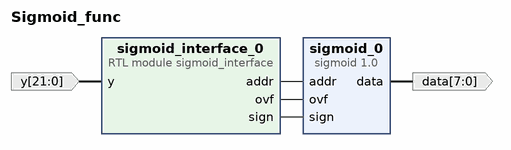
[diagram p0: block diagram of the top level]
# Vivado block design Sigmoid_func, xc7a35tcpg236-1, Vivado 2022.2
create_bd_design Sigmoid_func

create_bd_port -dir I -from 21 -to 0 y
create_bd_port -dir O -from 7 -to 0 data

create_bd_cell -type ip -vlnv siu.edu:user:sigmoid:1.0 sigmoid_0
create_bd_cell -type module -reference sigmoid_interface sigmoid_interface_0

# ---- connections ----

connect_bd_net [get_bd_pins sigmoid_0/data] [get_bd_ports data]
connect_bd_net [get_bd_pins sigmoid_interface_0/addr] [get_bd_pins sigmoid_0/addr]
connect_bd_net [get_bd_pins sigmoid_interface_0/ovf] [get_bd_pins sigmoid_0/ovf]
connect_bd_net [get_bd_pins sigmoid_interface_0/sign] [get_bd_pins sigmoid_0/sign]
connect_bd_net -net y_0_1 [get_bd_ports y] [get_bd_pins sigmoid_interface_0/y]

validate_bd_design
save_bd_design
